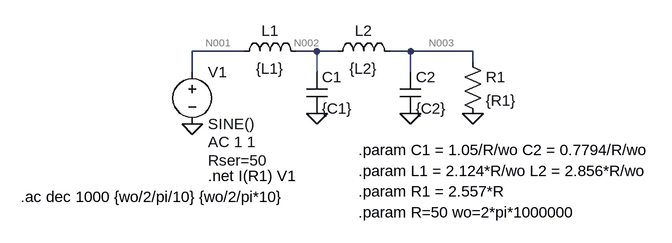
[diagram p0: schematic Draft2.asc]
Draft2.asc, the LTspice schematic file:
Version 4
SHEET 1 880 680
WIRE 112 96 32 96
WIRE 224 96 192 96
WIRE 256 96 224 96
WIRE 368 96 336 96
WIRE 464 96 368 96
WIRE 464 112 464 96
WIRE 32 128 32 96
WIRE 224 128 224 96
WIRE 368 128 368 96
FLAG 32 208 0
FLAG 224 192 0
FLAG 368 192 0
FLAG 464 192 0
SYMBOL voltage 32 112 R0
WINDOW 123 24 124 Left 2
WINDOW 39 24 152 Left 2
SYMATTR Value2 AC 1 1
SYMATTR SpiceLine Rser=50
SYMATTR InstName V1
SYMATTR Value SINE()
SYMBOL ind 96 112 R270
WINDOW 0 32 56 VTop 2
WINDOW 3 5 56 VBottom 2
SYMATTR InstName L1
SYMATTR Value {L1}
SYMBOL cap 208 128 R0
SYMATTR InstName C1
SYMATTR Value {C1}
SYMBOL ind 240 112 R270
WINDOW 0 32 56 VTop 2
WINDOW 3 5 56 VBottom 2
SYMATTR InstName L2
SYMATTR Value {L2}
SYMBOL cap 352 128 R0
SYMATTR InstName C2
SYMATTR Value {C2}
SYMBOL res 448 96 R0
SYMATTR InstName R1
SYMATTR Value {R1}
TEXT 56 288 Left 2 !.net I(R1) V1
TEXT -232 320 Left 2 !.ac dec 1000 {wo/2/pi/10} {wo/2/pi*10}
TEXT 288 248 Left 2 !.param C1 = 1.05/R/wo C2 = 0.7794/R/wo
TEXT 288 280 Left 2 !.param L1 = 2.124*R/wo L2 = 2.856*R/wo
TEXT 288 312 Left 2 !.param R1 = 2.557*R
TEXT 288 344 Left 2 !.param R=50 wo=2*pi*1000000

The netlist it stands for:
* Draft2.asc
V1 N001 0 SINE() AC 1 1 Rser=50
L1 N001 N002 {L1}
C1 N002 0 {C1}
L2 N002 N003 {L2}
C2 N003 0 {C2}
R1 N003 0 {R1}
.net I(R1) V1
.ac dec 1000 {wo/2/pi/10} {wo/2/pi*10}
.param C1 = 1.05/R/wo C2 = 0.7794/R/wo
.param L1 = 2.124*R/wo L2 = 2.856*R/wo
.param R1 = 2.557*R
.param R=50 wo=2*pi*1000000
.backanno
.end

* Results of the author's LTspice run, read from the files saved beside the schematic
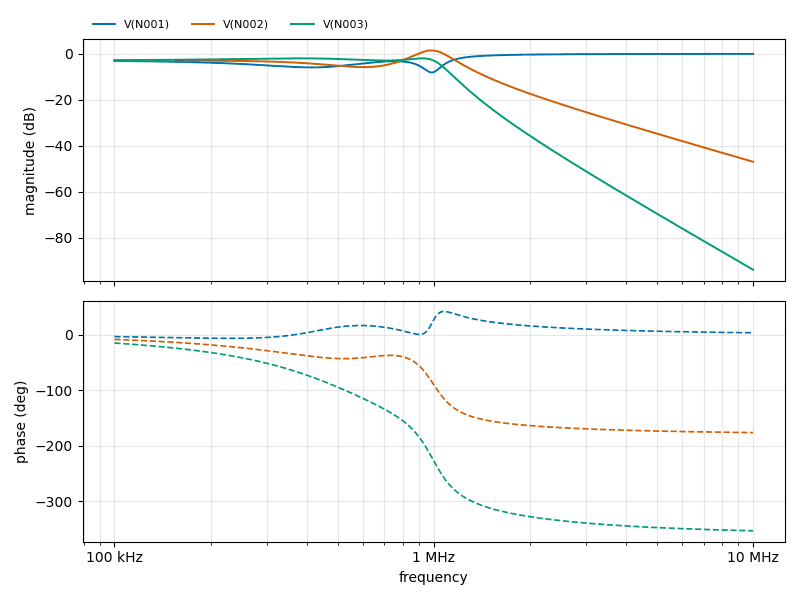
[diagram p1: AC Analysis of Draft2.asc, plotted from the saved traces]
* AC Analysis, 1 run:
*   V(N001): -3.10 dB at 100 kHz, -0.01 dB at 10 MHz, peak -0.01 dB at 10 MHz, 3 dB below the peak at 1.132 MHz
*   V(N002): -2.88 dB at 100 kHz, -46.91 dB at 10 MHz, peak 1.51 dB at 984 kHz, 3 dB below the peak at 842 kHz and 1.125 MHz
*   V(N003): -2.74 dB at 100 kHz, -93.83 dB at 10 MHz, peak -1.94 dB at 922.6 kHz, 3 dB below the peak at 1.054 MHz